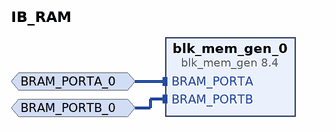
[diagram p0: block diagram of the top level]
# Vivado block design IB_RAM, xczu7ev-ffvc1156-2-e, Vivado 2019.2
create_bd_design IB_RAM

create_bd_intf_port -mode Slave -vlnv xilinx.com:interface:bram_rtl:1.0 BRAM_PORTA_0
create_bd_intf_port -mode Slave -vlnv xilinx.com:interface:bram_rtl:1.0 BRAM_PORTB_0

create_bd_cell -type ip -vlnv xilinx.com:ip:blk_mem_gen:8.4 blk_mem_gen_0
set_property -dict [list \
  CONFIG.Assume_Synchronous_Clk true \
  CONFIG.Coe_File ../../../../../../../../../python_prj/COE_BRAM32_0_3/Iter_0/lut_Iter0_Func0_3.coe \
  CONFIG.Enable_32bit_Address false \
  CONFIG.Enable_A Always_Enabled \
  CONFIG.Enable_B Always_Enabled \
  CONFIG.Load_Init_File true \
  CONFIG.Memory_Type Dual_Port_ROM \
  CONFIG.Port_A_Write_Rate 0 \
  CONFIG.Port_B_Clock 100 \
  CONFIG.Port_B_Enable_Rate 100 \
  CONFIG.Port_B_Write_Rate 0 \
  CONFIG.Register_PortA_Output_of_Memory_Primitives false \
  CONFIG.Register_PortB_Output_of_Memory_Primitives false \
  CONFIG.Use_RSTA_Pin false \
  CONFIG.Write_Depth_A 128 \
  CONFIG.use_bram_block Stand_Alone \
] [get_bd_cells blk_mem_gen_0]

# ---- connections ----

connect_bd_intf_net -intf_net BRAM_PORTA_0_1 [get_bd_intf_ports BRAM_PORTA_0] [get_bd_intf_pins blk_mem_gen_0/BRAM_PORTA]
connect_bd_intf_net -intf_net BRAM_PORTB_0_1 [get_bd_intf_ports BRAM_PORTB_0] [get_bd_intf_pins blk_mem_gen_0/BRAM_PORTB]

validate_bd_design
save_bd_design
